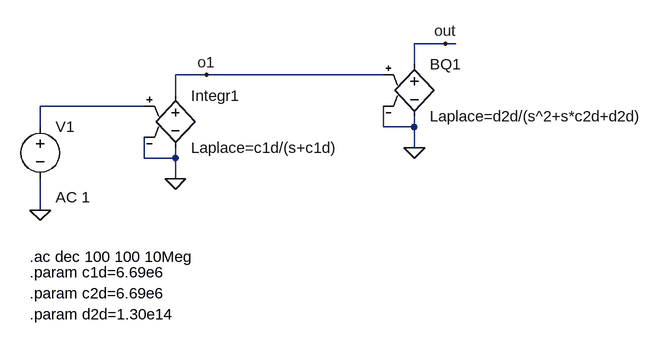
[diagram p0: schematic FDT.asc]
FDT.asc, the LTspice schematic file:
Version 4.1
SHEET 1 880 680
WIRE 464 -64 416 -64
WIRE 480 -64 464 -64
WIRE 416 -32 416 -64
WIRE 96 -16 48 -16
WIRE 368 -16 96 -16
WIRE 48 16 48 -16
WIRE 0 32 -160 32
WIRE -160 64 -160 32
WIRE 368 64 368 32
WIRE 416 64 416 48
WIRE 416 64 368 64
WIRE 416 96 416 64
WIRE 0 112 0 80
WIRE 48 112 48 96
WIRE 48 112 0 112
WIRE 48 144 48 112
WIRE -160 192 -160 144
FLAG -160 192 0
FLAG 48 144 0
FLAG 96 -16 o1
FLAG 416 96 0
FLAG 464 -64 out
SYMBOL voltage -160 48 R0
WINDOW 123 24 124 Left 2
WINDOW 39 0 0 Left 0
SYMATTR Value2 AC 1
SYMATTR InstName V1
SYMATTR Value ""
SYMBOL e 48 0 R0
SYMATTR InstName Integr1
SYMATTR Value Laplace=c1d/(s+c1d)
SYMBOL e 416 -48 R0
SYMATTR InstName BQ1
SYMATTR Value Laplace=d2d/(s^2+s*c2d+d2d)
TEXT -176 264 Left 2 !.ac dec 100 100 10Meg
TEXT -176 288 Left 2 !.param c1d=6.69e6
TEXT -176 320 Left 2 !.param c2d=6.69e6
TEXT -176 352 Left 2 !.param d2d=1.30e14

The netlist it stands for:
* FDT.asc
V1 N001 0 AC 1
E§Integr1 o1 0 N001 0 Laplace=c1d/(s+c1d)
E§BQ1 out 0 o1 0 Laplace=d2d/(s^2+s*c2d+d2d)
.ac dec 100 100 10Meg
.param c1d=6.69e6
.param c2d=6.69e6
.param d2d=1.30e14
.backanno
.end